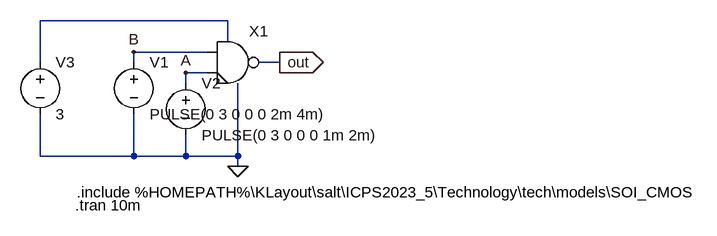
[diagram p0: schematic nand_min_tb.asc]
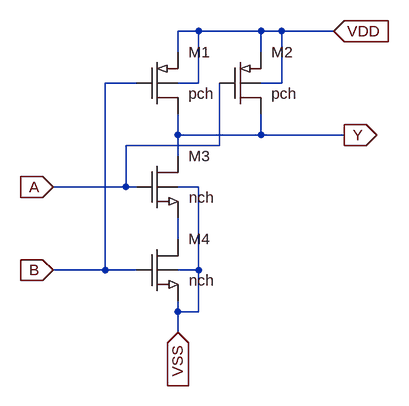
[diagram p1: sub-circuit nand_min.asc]
nand_min_tb.asc, the LTspice schematic file:
Version 4
SHEET 1 944 680
WIRE 160 0 -128 0
WIRE 160 32 160 0
WIRE 128 48 16 48
WIRE -128 64 -128 0
WIRE 16 64 16 48
WIRE 240 64 208 64
WIRE 128 80 96 80
WIRE 96 96 96 80
WIRE -128 208 -128 144
WIRE 16 208 16 144
WIRE 16 208 -128 208
WIRE 96 208 96 176
WIRE 96 208 16 208
WIRE 176 208 176 96
WIRE 176 208 96 208
WIRE 176 224 176 208
FLAG 176 224 0
FLAG 240 64 out
IOPIN 240 64 Out
FLAG 96 80 A
FLAG 16 48 B
SYMBOL nand_min 176 112 R0
SYMATTR InstName X1
SYMBOL voltage 16 48 R0
SYMATTR InstName V1
SYMATTR Value PULSE(0 3 0 0 0 2m 4m)
SYMBOL voltage 96 80 R0
WINDOW 123 0 0 Left 0
WINDOW 39 0 0 Left 0
SYMATTR InstName V2
SYMATTR Value PULSE(0 3 0 0 0 1m 2m)
SYMBOL voltage -128 48 R0
SYMATTR InstName V3
SYMATTR Value 3
TEXT -72 264 Left 2 !.include %HOMEPATH%\\KLayout\\salt\\ICPS2023_5\\Technology\\tech\\models\\SOI_CMOS
TEXT -74 284 Left 2 !.tran 10m

nand_min.asc, the sub-circuit schematic file:
Version 4
SHEET 1 880 680
WIRE -144 -16 -176 -16
WIRE -48 -16 -144 -16
WIRE -16 -16 -48 -16
WIRE 64 -16 -16 -16
WIRE -176 16 -176 -16
WIRE -48 16 -48 -16
WIRE -240 64 -288 64
WIRE -144 64 -144 -16
WIRE -144 64 -176 64
WIRE -16 64 -16 -16
WIRE -16 64 -48 64
WIRE -176 144 -176 112
WIRE -48 144 -48 112
WIRE -48 144 -176 144
WIRE 80 144 -48 144
WIRE -112 160 -112 64
WIRE -112 160 -256 160
WIRE -176 176 -176 144
WIRE -256 224 -256 160
WIRE -256 224 -368 224
WIRE -240 224 -256 224
WIRE -144 224 -176 224
WIRE -176 304 -176 272
WIRE -288 352 -288 64
WIRE -288 352 -368 352
WIRE -240 352 -288 352
WIRE -144 352 -144 224
WIRE -144 352 -176 352
WIRE -176 416 -176 400
WIRE -144 416 -144 352
WIRE -144 416 -176 416
WIRE -176 448 -176 416
FLAG -368 224 A
IOPIN -368 224 In
FLAG -368 352 B
IOPIN -368 352 In
FLAG 80 144 Y
IOPIN 80 144 Out
FLAG 64 -16 VDD
IOPIN 64 -16 In
FLAG -176 448 VSS
IOPIN -176 448 In
SYMBOL MinedaLIB\\PMOS_MIN -240 64 R0
SYMATTR InstName M1
SYMATTR Value2 l=10.0U w=40.0U
SYMBOL MinedaLIB\\PMOS_MIN -112 64 R0
SYMATTR InstName M2
SYMATTR Value2 l=10.0U w=40.0U
SYMBOL MinedaLIB\\NMOS_MIN -240 224 R0
SYMATTR InstName M3
SYMATTR Value2 l=10.0U w=10.0U
SYMBOL MinedaLIB\\NMOS_MIN -240 352 R0
SYMATTR InstName M4
SYMATTR Value2 l=10.0U w=10.0U

The netlist it stands for:
* nand_min_tb.asc
XX1 B A N001 0 out nand_min
V1 B 0 PULSE(0 3 0 0 0 2m 4m)
V2 A 0 PULSE(0 3 0 0 0 1m 2m)
V3 N001 0 3

* block symbol definitions
.subckt nand_min A B VDD VSS Y
M1 Y B VDD VDD pch l=10.0U w=40.0U
M2 Y A VDD VDD pch l=10.0U w=40.0U
M3 Y A N001 VSS nch l=10.0U w=10.0U
M4 N001 B VSS VSS nch l=10.0U w=10.0U
.ends nand_min

.model NMOS NMOS
.model PMOS PMOS
.lib standard.mos
.include %HOMEPATH%\KLayout\salt\ICPS2023_5\Technology\tech\models\SOI_CMOS
.tran 10m
.backanno
.end

* Results of the author's LTspice run, read from the files saved beside the schematic
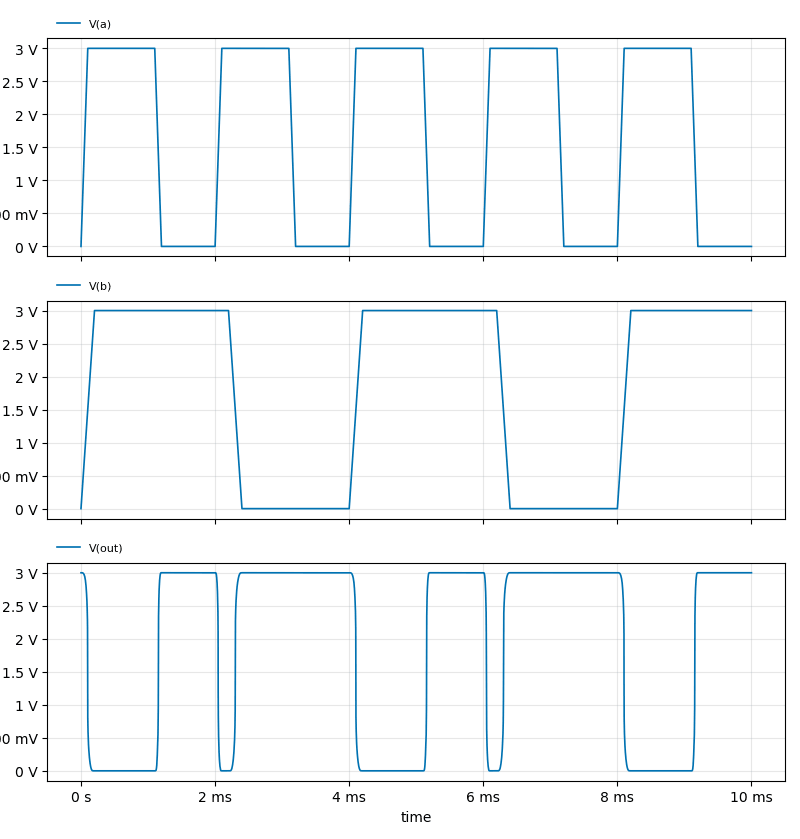
[diagram p2: Transient Analysis of nand_min_tb.asc, plotted from the saved traces]
* Transient Analysis, 1 run:
*   V(a): min 0 V, max 3 V, average 1.65 V, rms 2.191 V, last 0 V
*   V(b): min 0 V, max 3 V, average 1.89 V, rms 2.35 V, last 3 V
*   V(out): min -76.99 µV, max 3 V, average 1.899 V, rms 2.374 V, last 3 V